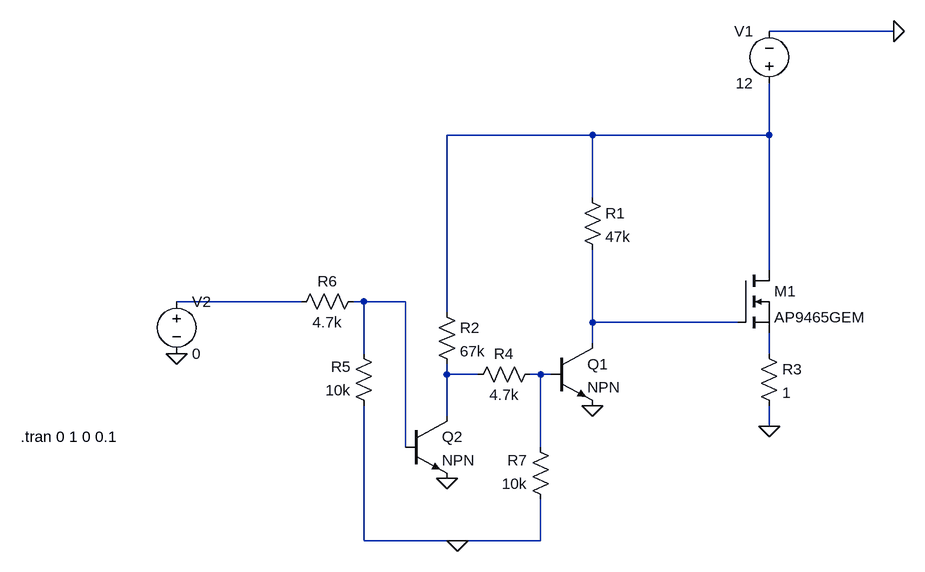
[diagram p0: schematic test underv prot.asc]
test underv prot.asc, the LTspice schematic file:
Version 4
SHEET 1 880 680
WIRE 736 -224 544 -224
WIRE 272 -64 48 -64
WIRE 544 -64 544 -144
WIRE 544 -64 272 -64
WIRE 272 32 272 -64
WIRE 544 144 544 -64
WIRE -176 192 -368 192
WIRE -80 192 -96 192
WIRE -16 192 -80 192
WIRE 48 208 48 -64
WIRE 272 224 272 112
WIRE 496 224 272 224
WIRE 272 256 272 224
WIRE -80 272 -80 192
WIRE 544 272 544 240
WIRE 48 304 48 288
WIRE 96 304 48 304
WIRE 192 304 176 304
WIRE 208 304 192 304
WIRE 48 368 48 304
WIRE 544 384 544 352
WIRE -16 416 -16 192
WIRE 192 416 192 304
WIRE -80 560 -80 352
WIRE 64 560 -80 560
WIRE 192 560 192 496
WIRE 192 560 64 560
FLAG 736 -224 0
FLAG 544 384 0
FLAG -368 272 0
FLAG 272 352 0
FLAG 48 464 0
FLAG 64 560 0
SYMBOL nmos 496 144 R0
SYMATTR InstName M1
SYMATTR Value AP9465GEM
SYMBOL voltage 544 -128 R180
WINDOW 0 24 96 Left 2
WINDOW 3 24 16 Left 2
WINDOW 123 0 0 Left 0
WINDOW 39 0 0 Left 0
SYMATTR InstName V1
SYMATTR Value 12
SYMBOL voltage -368 176 R0
WINDOW 123 0 0 Left 0
WINDOW 39 0 0 Left 0
SYMATTR InstName V2
SYMATTR Value 0
SYMBOL res 256 16 R0
SYMATTR InstName R1
SYMATTR Value 47k
SYMBOL npn -16 368 R0
SYMATTR InstName Q2
SYMBOL res 32 192 R0
SYMATTR InstName R2
SYMATTR Value 67k
SYMBOL npn 208 256 R0
SYMATTR InstName Q1
SYMBOL res 192 288 R90
WINDOW 0 0 56 VBottom 2
WINDOW 3 32 56 VTop 2
SYMATTR InstName R4
SYMATTR Value 4.7k
SYMBOL res 528 256 R0
SYMATTR InstName R3
SYMATTR Value 1
SYMBOL res -80 176 R90
WINDOW 0 0 56 VBottom 2
WINDOW 3 32 56 VTop 2
SYMATTR InstName R6
SYMATTR Value 4.7k
SYMBOL res -64 368 R180
WINDOW 0 36 76 Left 2
WINDOW 3 36 40 Left 2
SYMATTR InstName R5
SYMATTR Value 10k
SYMBOL res 208 512 R180
WINDOW 0 36 76 Left 2
WINDOW 3 36 40 Left 2
SYMATTR InstName R7
SYMATTR Value 10k
TEXT -608 400 Left 2 !.tran 0 1 0 0.1

The netlist it stands for:
* test underv prot.asc
M1 N001 N004 N005 N005 AP9465GEM
V1 N001 0 12
V2 N002 0 0
R1 N001 N004 47k
Q2 N006 N003 0 0 NPN
R2 N001 N006 67k
Q1 N004 N007 0 0 NPN
R4 N007 N006 4.7k
R3 N005 0 1
R6 N003 N002 4.7k
R5 0 N003 10k
R7 0 N007 10k
.model NPN NPN
.model PNP PNP
.lib standard.bjt
.model NMOS NMOS
.model PMOS PMOS
.lib standard.mos
.tran 0 1 0 0.1
.backanno
.end